# EAGLE design Adafruit NeoKey Breakout (EAGLE 9.6.2)
COMPANY: ADAFRUIT INDUSTRIES; DRAWN: KTOWN; REV: A
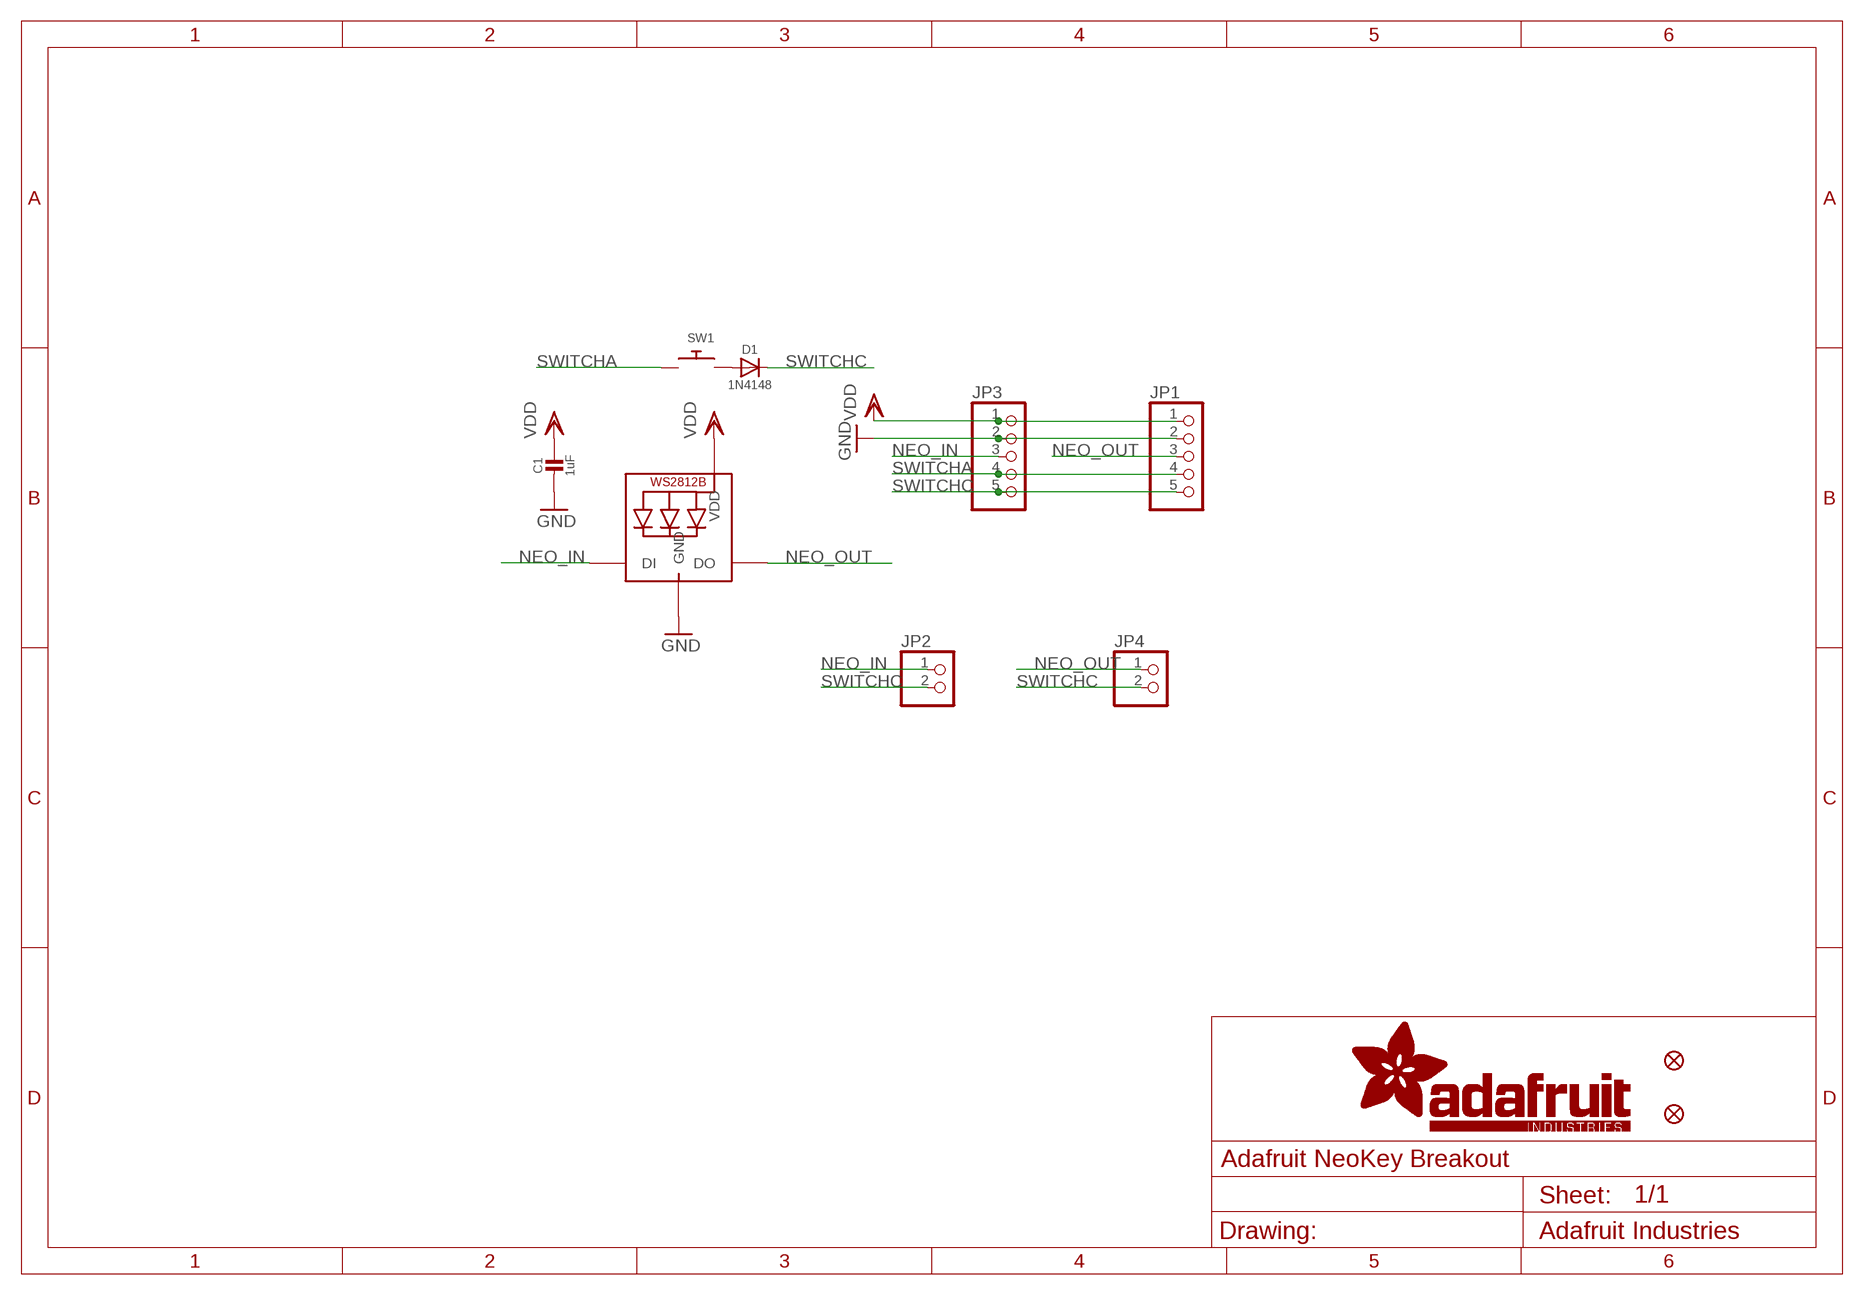
[diagram p0: schematic, sheet 1]

## Parts
C1  1uF  CAP_CERAMIC0603_NO  [0603-NO]
D1  1N4148  DIODESOD-323  [SOD-323]
FID3  FIDUCIAL_1MM  [FIDUCIAL_1MM]
FID4  FIDUCIAL_1MM  [FIDUCIAL_1MM]
JP1  HEADER-1X570MIL  [1X05_ROUND_70]
JP2  HEADER-1X2ROUND  [1X02_ROUND]
JP3  HEADER-1X570MIL  [1X05_ROUND_70]
JP4  HEADER-1X2ROUND  [1X02_ROUND]
LED1  WS2812B_SK6812E  [NEO3535_REVERSE]
SW1  SWITCH_PUSHBUTTON_KAILH_SOCKET  [KAILH_SOCKET]

## Nets
GND: C1.2 JP1.2 JP3.2 LED1.3-GND(GND)
N$2: D1.A SW1.1
NEO_IN: JP2.1 JP3.3 LED1.4-DIN(DI)
NEO_OUT: JP1.3 JP4.1 LED1.2-DOUT(DO)
SWITCHA: JP1.4 JP3.4 SW1.2
SWITCHC: D1.C JP1.5 JP2.2 JP3.5 JP4.2
VDD: C1.1 JP1.1 JP3.1 LED1.1-VDD(VDD)

## Library data of the parts
C1 = microbuilder:CAP_CERAMIC: Ceramic Capacitors For new designs, use the packages preceded by an '_' character since they are more reliable: The following footprints should be used on most boards: _0402 - Standard footprint for regular board layouts _0603 - Standard footprint for regular board layouts _0805 - Standard footprint for regular board layouts _1206 - Standard footprint for regular board layouts For extremely tight-pitch boards where space is at a premium, the following 'micro-pitch' footprints can be used (smaller pads, no silkscreen outline, etc.): _0402MP - Micro-pitch footprint for very dense/compact boards _0603MP - Micro-pitch footprint for very dense/compact boards _0805MP - Micro-pitch footprint for very dense/compact boards _1206MP - Micro-pitch footprint for very dense/compact boards
D1 = microbuilder:DIODE: Diode SMA Model Volts Amps Type Vf Ir Digikey # Notes SSA34-E3 40V 3A Schottky 480mV @ 3A 200uA @ 40V SSA34-E3/61TGITR-ND CDBA120-G 20V 1A Schottky 500mV @ 1A 500uA @ 20V 641-1014-6-ND REEL MBRA210 10V 2A Schottky 350mV @ 2A 700uA @ 10V MBRA210LT3 SOD-123 Model Volts Amps Type Vf Ir Order # Notes BAT54T1G 30V 200mA Schottky 800mV @ 200mA 2uA @ 25V BAT54T1GOSTR-ND B0530W 30V 500mA Schottky 430mV @ 500mA 130uA @ 30V B0530W-FDICT-ND REEL MBR120 20V 1A Schottky 340mV @ 1A MBR120VLSFT1GOSCT-ND SOD-323 Model Volts Amps Type Vf Ir Order # Notes PMEG2005EJ 20V 500mA Schottky 355mV @ 500mA 568-4110-1-ND ZLLS410 10V 570mA Schottky 380mV @ 570mA ZLLS410CT-ND 1N4148WS 75V 150mA Silicon/Simple 1V 1N4148WSFSCT-ND REEL SOD-523 Model Volts Amps Type Vf Ir Order # Notes BAT54XV2 30V 200mA Schottky 0.8V @ 100mA BAT54XV2CT-ND TB751S 30V 30mA Schottky RB751S-40TE61CT-ND SOT23-R/W (R = Solder Paste/Reflow Ovens, W = Hand-Soldering) Model Volts Amps Type Vf Ir Order # Notes BAT54FILM 40V 300mA Schottky 497-7162-1-ND POWERDI-5 Model Volts Amps Type Vf Ir Order # Notes PDS560 60V 5A Schottky 670mV @ 5A 150uA @ 60V PDS560DICT-ND
FID3 FID4 = microbuilder:FIDUCIAL: Fiducial Alignment Points Various fiducial points for machine vision alignment.; BOM: EXCLUDE
JP1 JP3 = microbuilder:HEADER-1X5: PIN HEADER
JP2 JP4 = microbuilder:HEADER-1X2: PIN HEADER
LED1 = microbuilder:WS2812B
SW1 = adafruit_electromech:SWITCH_PUSHBUTTON: Buttons SOFTTOUCHSMD_SJ - Soft touch temporary push button (Super Junk Akihabara) Compatible with SKPMANE010 [Mouser: 688-SKPMAN] C&K_KSS = Digikey: KSS221GLFS

## Net classes
1 highpower: width 0.305 mm, drill 0.483 mm
2 lowpower: width 0.254 mm, drill 0.483 mm

## Board
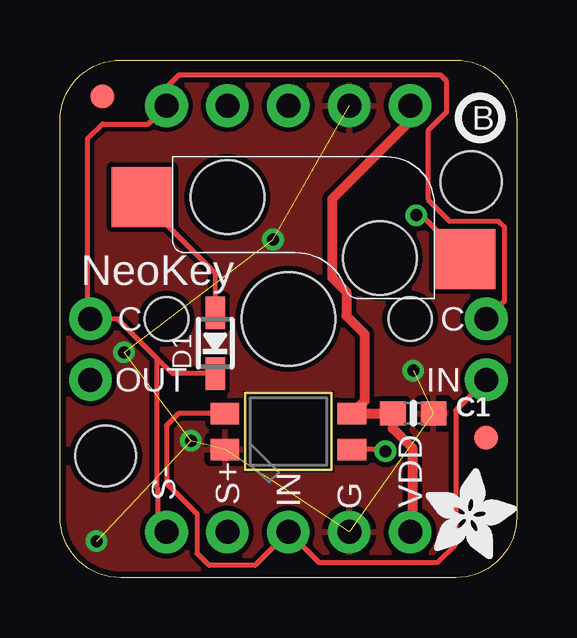
[diagram p1: board, top side]
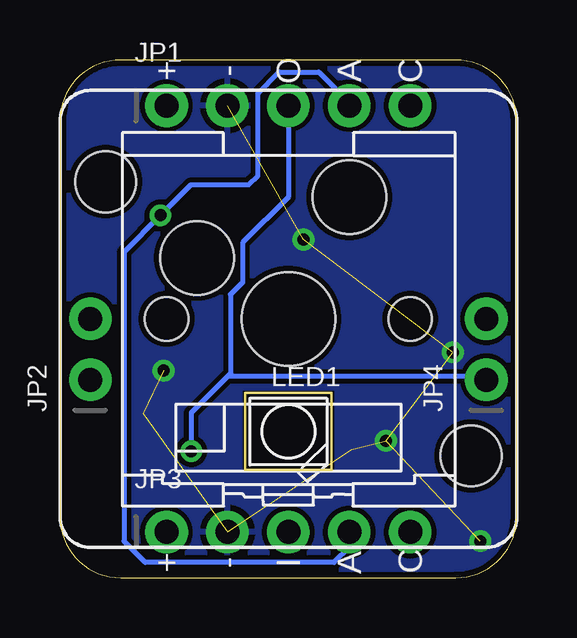
[diagram p2: board, bottom side, seen from below]

Size 19.05 x 21.59 mm. Coordinates in mm from the lower left corner, seen from the top.
Outline: 19.05,19.05 19.05,2.54 arc-90 16.51,0 2.54,0 arc-90 0,2.54 0,19.05 arc-90 2.54,21.59 16.51,21.59 arc-90 19.05,19.05
Copper layers (1*16): Top 0.035mm / dielectric 1.5mm / Bottom 0.035mm
Design rules "adafruit *": minimum track width 8mil, minimum drill 15.5mil, track to track 8mil, track to pad 8mil, pad to pad 8mil, via to via 8mil, smd to smd 8mil, copper to edge 10mil, drill to drill 8mil, minimum pad ring 10mil, minimum via ring 8mil, stop-mask expansion 2mil, vias tented up to drill 20mil, thermal gap 10mil
Holes 2.54 mm at 17.14,16.51 1.91,5.08

### Footprints (pad centres in the part's own frame; a part is rotated, then mirrored left to right if it is on the bottom)
0603-NO = smd 1.075 x 1: 1 -0.85,0; 2 0.85,0
SOD-323 = smd 1.35 x 0.8: A 1.27,0; C -1.27,0
FIDUCIAL_1MM = smd 1 x 1: 1 0,0
1X05_ROUND_70 = drill 1 pad 1.778: 1 -5.08,0; 2 -2.54,0; 3 0,0; 4 2.54,0; 5 5.08,0
1X02_ROUND = drill 1 pad 1.778: 1 -1.27,0; 2 1.27,0
NEO3535_REVERSE = smd 1.2 x 0.9 bottom: 1-VDD 2.65,-0.75; 2-DOUT 2.65,0.75; 3-GND -2.65,0.75; 4-DIN -2.65,-0.75
KAILH_SOCKET = smd 2.55 x 2.5 bottom: 1 6.09,5.08; 2 -7.36,2.5 | hole 3.9: 0,0 | hole 3.063: 2.54,5.08; -3.81,2.54 | hole 1.813: 5.08,0; -5.08,0

### Placement (x,y rotation side)
C1  14.73,6.86 0 top
D1  6.48,9.78 90 top
FID3  17.78,5.84 0 top
FID4  1.78,20.07 0 top
JP1  9.53,19.68 0 bottom
JP2  17.78,9.53 90 bottom
JP3  9.53,1.91 0 bottom
JP4  1.27,9.53 90 bottom
LED1  9.53,6.1 180 bottom
SW1  9.53,10.79 0 bottom
U$1  [PCBFEAT-REV-040]  17.53,19.18 0 top
U$2  [ADAFRUIT_3.5MM]  15.24,0.76 0 top

### Tracks (layer width: path | path; a pad name or v marks a point on that pad's centre or on a via)
GND  (via drill 0.5)  (8 unrouted)
  other vias: 5.46,5.71 14.73,8.64 8.89,14.1 2.67,9.4 1.52,1.52
  pour Top: 19.05,21.59 0,21.59 0,0 19.05,0
  pour Bottom: 19.05,21.59 0,21.59 0,0 19.05,0
N$2
  Top 0.203: SW1.1 3.44,15.74 6.48,12.7 D1.A
NEO_IN
  Top 0.203: JP2.1 16.51,6.98 16.51,1.4 15.75,0.64 10.79,0.64 JP3.3 8.13,0.51 6.22,0.51 5.71,1.02 5.71,2.67 4.45,3.94 4.45,6.35 4.94,6.85 LED1.4-DIN
NEO_OUT  (via drill 0.5)
  Top 0.203: v13.58,5.28 13.5,5.35 LED1.2-DOUT
  Bottom 0.203: JP1.3 9.53,15.88 11.43,13.97 11.43,12.32 11.94,11.81 11.94,8.51 12.06,8.38 | JP4.1 1.4,8.38 12.06,8.38 | 12.06,8.38 13.58,6.87 v13.58,5.28
SWITCHA  (via drill 0.5)
  Top 0.203: v14.86,15.11 15.07,15.11 SW1.2
  Bottom 0.203: JP3.4 6.99,1.27 7.62,0.64 15.49,0.64 16.38,1.52 16.38,13.59 v14.86,15.11 13.59,16.38 11.18,16.38 10.79,16.76 10.79,20.19 9.91,21.08 8.26,21.08 6.99,19.81 JP1.4
SWITCHC
  Top 0.203: D1.C 4.7,8.51 4.04,9.17 | 4.04,9.17 2.41,10.79 JP4.2 1.14,10.92 1.14,18.29 1.78,18.92 3.68,18.92 JP1.5 4.45,20.45 4.95,20.95 15.88,20.95 16.13,20.7 16.13,19.43 15.37,18.67 15.37,15.75 16.26,14.86 18.29,14.86 18.54,14.61 18.54,11.56 JP2.2 | 4.04,9.17 4.04,3.77 4.06,3.74 4.06,2.29 JP3.5
VDD
  Top 0.406: JP1.1 14.61,19.05 11.35,15.79 11.35,12.51 11.94,11.92 11.94,10.92 12.7,10.16 12.7,7.37 LED1.1-VDD 13.73,6.85 13.72,6.86 C1.1 13.88,6.22 14.69,5.42 14.69,1.99 JP3.1

### Text on the board
tPlace: NeoKey | C | C | OUT | IN | S- | S+ | VDD | IN | G
bPlace: C | A | O | - | + | C | A | I | - | +